# EAGLE design DRV10987 (EAGLE 8.7.1)
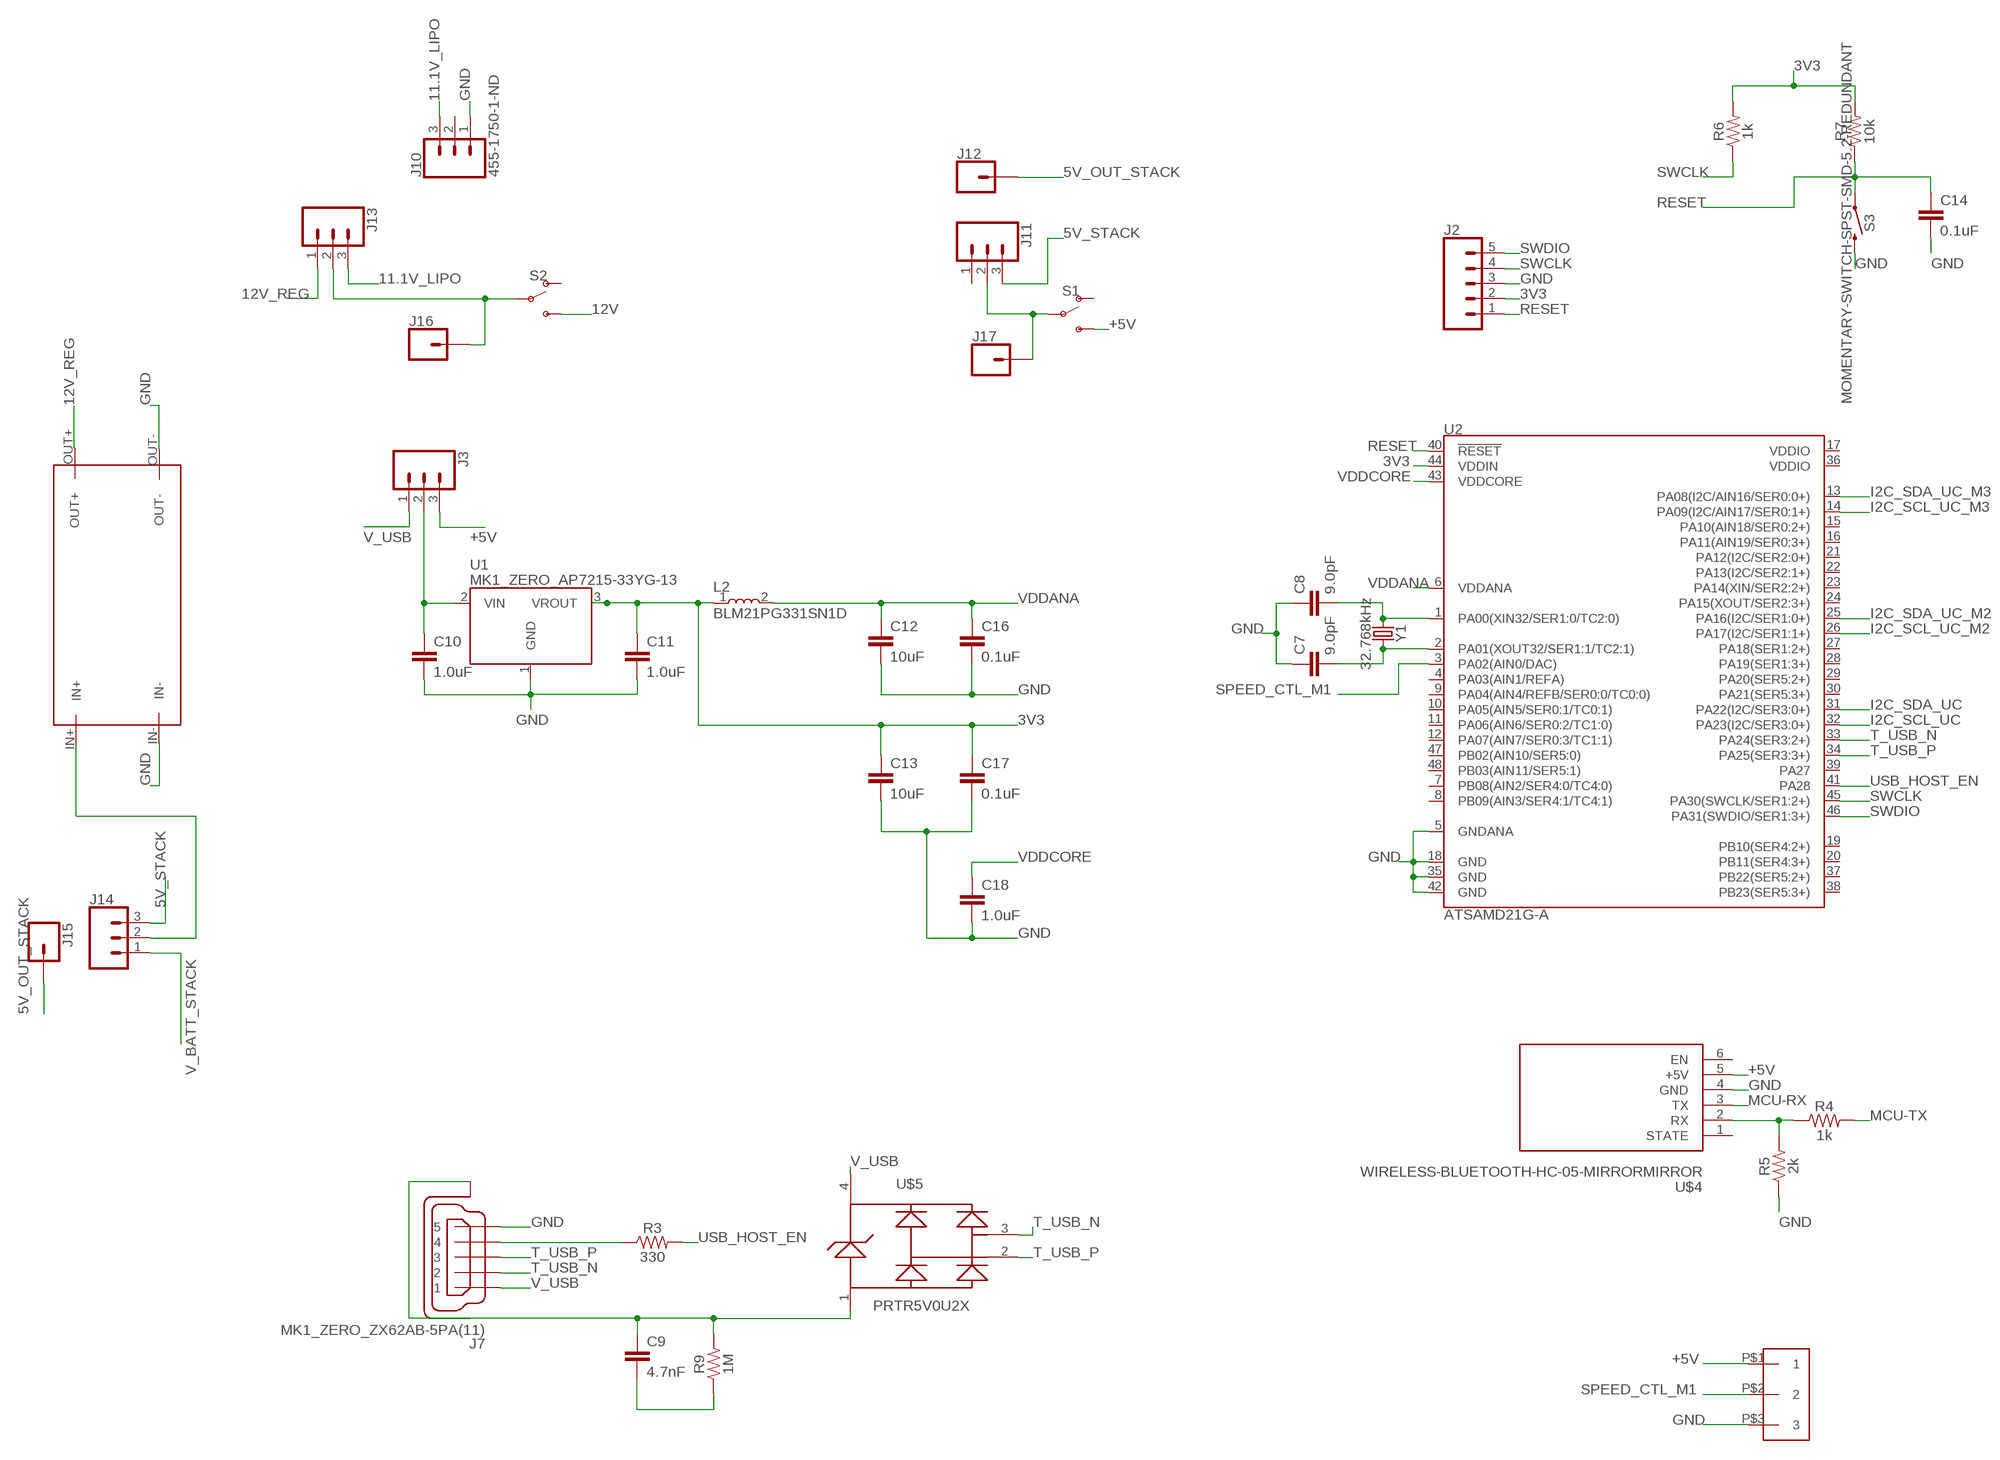
[diagram p0: schematic, sheet 1, part 1 of 2]
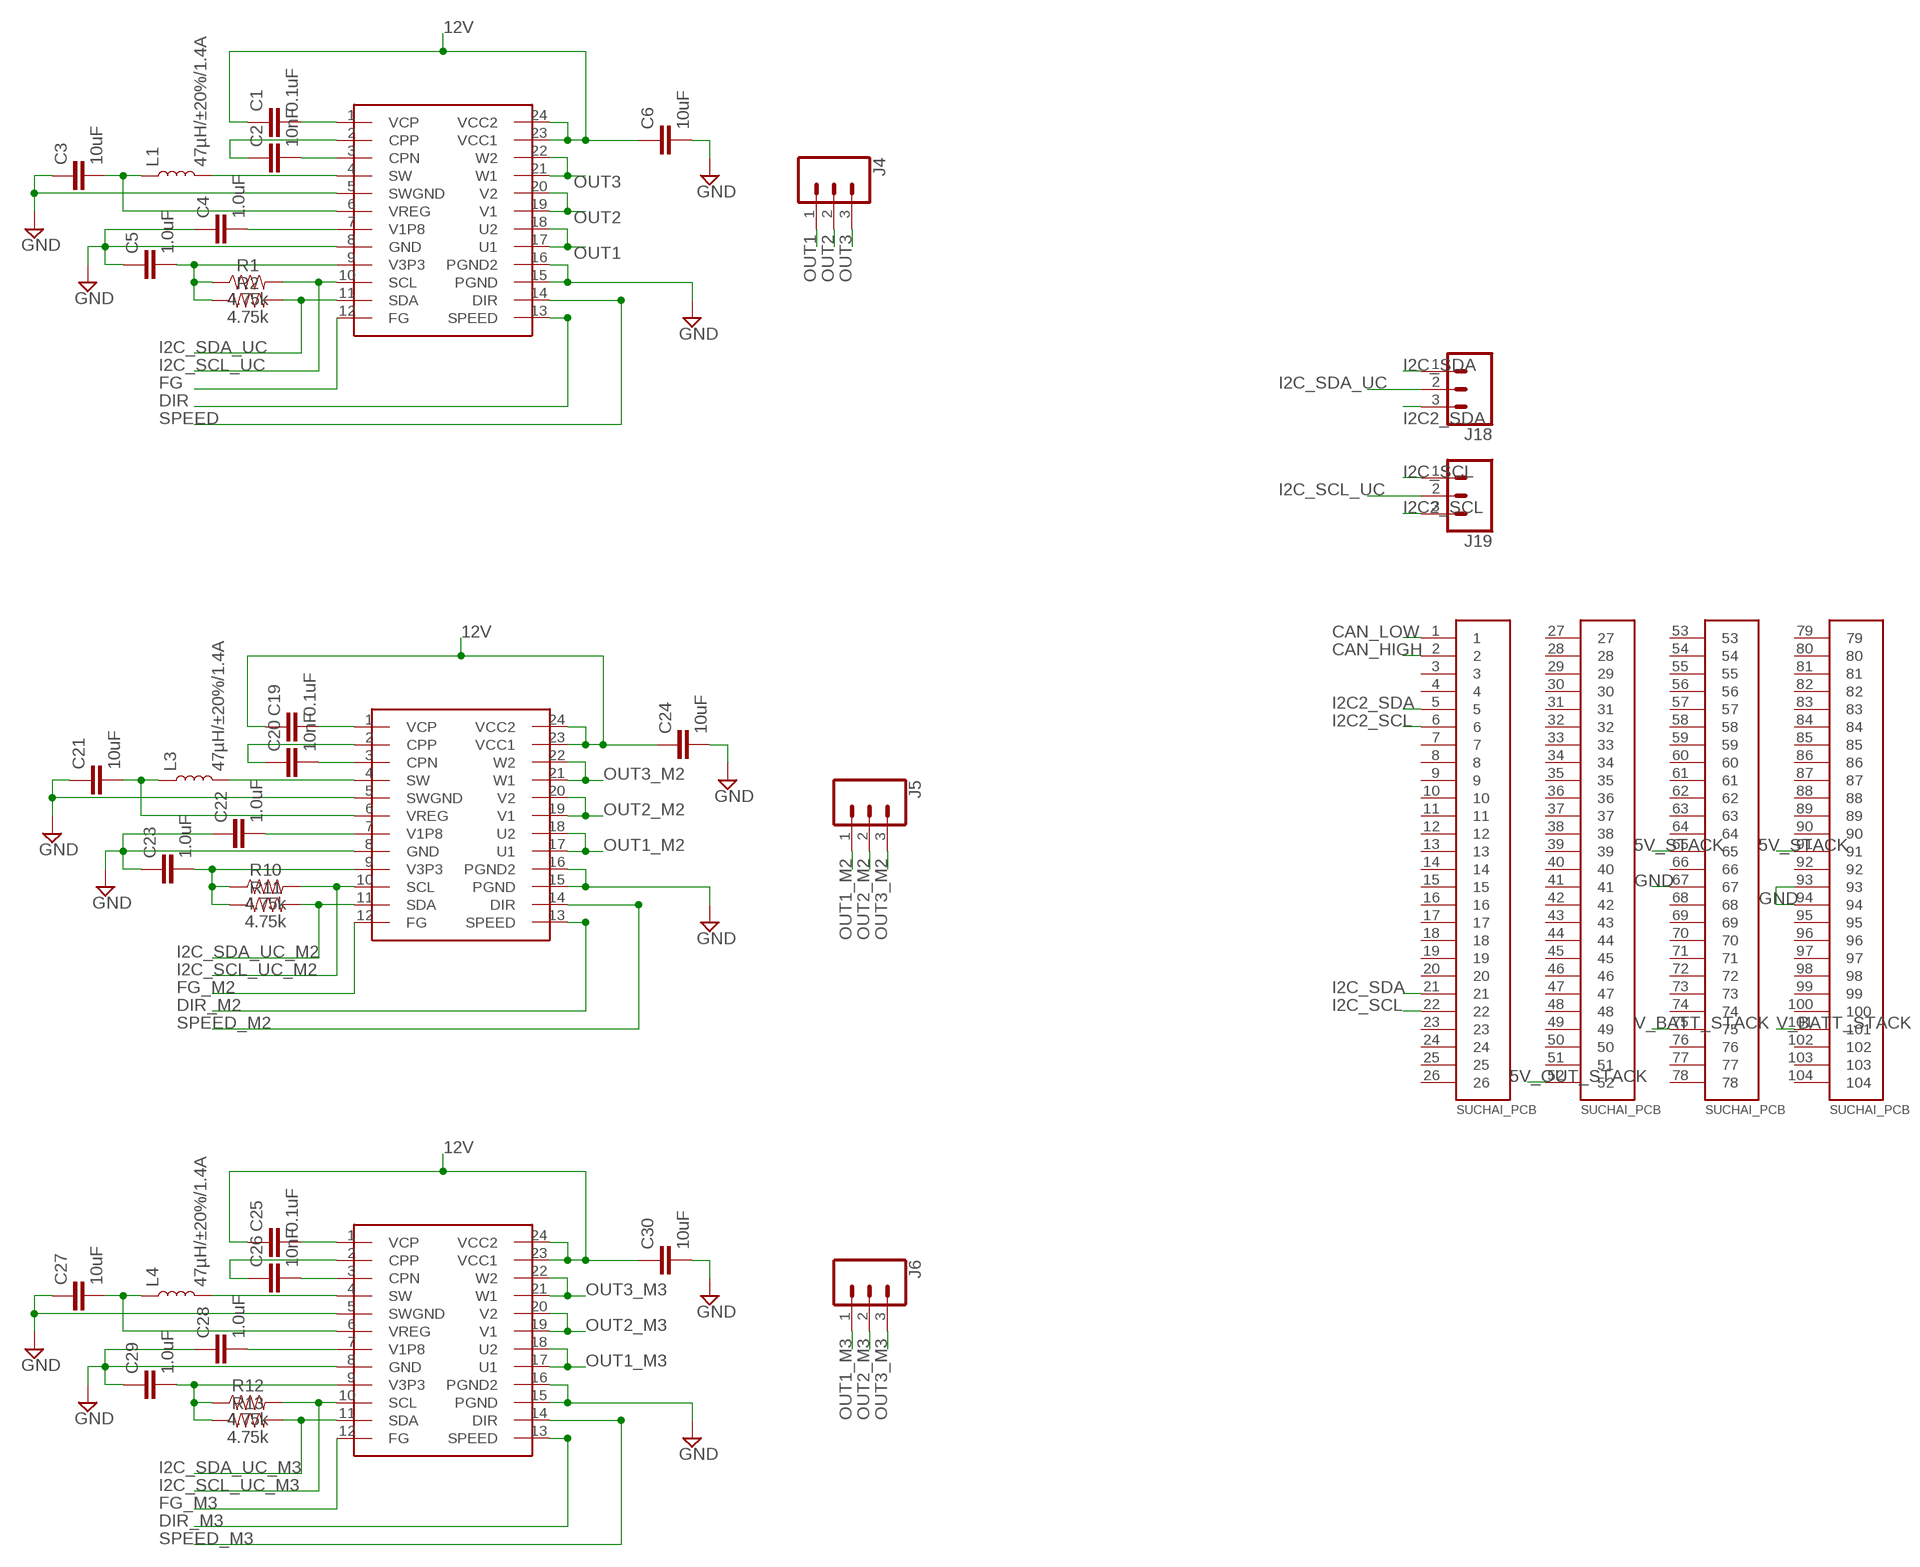
[diagram p1: schematic, sheet 1, part 2 of 2]

## Parts
C1  0.1uF  1.0UF-0805-25V-10%  [0805]
C2  10nF  1.0UF-0805-25V-10%  [0805]
C3  10uF  1.0UF-0805-25V-10%  [0805]
C4  1.0uF  1.0UF-0805-25V-10%  [0805]
C5  1.0uF  1.0UF-0805-25V-10%  [0805]
C6  10uF  1.0UF-0805-25V-10%  [0805]
C7  9.0pF  9.0PF-0603-50V-10%  [0603]
C8  9.0pF  9.0PF-0603-50V-10%  [0603]
C9  4.7nF  4.7PF-0603-50V-5%  [0603]
C10  1.0uF  1.0UF-0805-25V-(+80/-20%)  [0805]
C11  1.0uF  1.0UF-0805-25V-(+80/-20%)  [0805]
C12  10uF  10UF-0805-10V-10%  [0805]
C13  10uF  10UF-0805-10V-10%  [0805]
C14  0.1uF  1.0UF-0805-25V-(+80/-20%)  [0805]
C16  0.1uF  1.0UF-0805-25V-(+80/-20%)  [0805]
C17  0.1uF  1.0UF-0805-25V-(+80/-20%)  [0805]
C18  1.0uF  1.0UF-0805-25V-(+80/-20%)  [0805]
C19  0.1uF  1.0UF-0805-25V-10%  [0805]
C20  10nF  1.0UF-0805-25V-10%  [0805]
C21  10uF  1.0UF-0805-25V-10%  [0805]
C22  1.0uF  1.0UF-0805-25V-10%  [0805]
C23  1.0uF  1.0UF-0805-25V-10%  [0805]
C24  10uF  1.0UF-0805-25V-10%  [0805]
C25  0.1uF  1.0UF-0805-25V-10%  [0805]
C26  10nF  1.0UF-0805-25V-10%  [0805]
C27  10uF  1.0UF-0805-25V-10%  [0805]
C28  1.0uF  1.0UF-0805-25V-10%  [0805]
C29  1.0uF  1.0UF-0805-25V-10%  [0805]
C30  10uF  1.0UF-0805-25V-10%  [0805]
J1  SUCHAI_PCB  [SUCHAI_PCB]
J2  CONN_05LOCK_LONGPADS  [1X05_LOCK_LONGPADS]
J3  CONN_03LOCK_LONGPADS  [1X03_LOCK_LONGPADS]
J4  CONN_03LOCK  [1X03_LOCK]
J5  CONN_03LOCK  [1X03_LOCK]
J6  CONN_03LOCK  [1X03_LOCK]
J7  MK1_ZERO_ZX62AB-5PA(11)  [MK1_ZERO_USBMICRO-ZX62-AB-5PA]
J10  455-1750-1-ND  CONN_03  [1X03]
J11  CONN_03LOCK  [1X03_LOCK]
J12  CONN_01  [1X01]
J13  CONN_03LOCK  [1X03_LOCK]
J14  CONN_03LOCK  [1X03_LOCK]
J15  CONN_01  [1X01]
J16  CONN_01  [1X01]
J17  CONN_01  [1X01]
J18  CONN_03LOCK  [1X03_LOCK]
J19  CONN_03LOCK  [1X03_LOCK]
L1  47µH/±20%/1.4A  INDUCTOR-SRN6045-33UH  [SRN6045]
L2  BLM21PG331SN1D  [INDC2012X87]
L3  47µH/±20%/1.4A  INDUCTOR-SRN6045-33UH  [SRN6045]
L4  47µH/±20%/1.4A  INDUCTOR-SRN6045-33UH  [SRN6045]
R1  4.75k  RESISTOR0805  [0805]
R2  4.75k  RESISTOR0805  [0805]
R3  330  330OHM-0603-1/10W-1%  [0603]
R4  1k  1KOHM-HORIZ-1/4W-5%  [AXIAL-0.3]
R5  2k  RESISTORAXIAL-0.3  [AXIAL-0.3]
R6  1k  1KOHM-0603-1/10W-1%  [0603]
R7  10k  10KOHM-0603-1/10W-1%  [0603]
R9  1M  1MOHM-0603-1/4W-5%  [0603]
R10  4.75k  RESISTOR0805  [0805]
R11  4.75k  RESISTOR0805  [0805]
R12  4.75k  RESISTOR0805  [0805]
R13  4.75k  RESISTOR0805  [0805]
S1  SWITCH-SPDT-PTH-11.6X4.0MM  [SWITCH_SPDT_PTH_11.6X4.0MM]
S2  SWITCH-SPDT-PTH-11.6X4.0MM  [SWITCH_SPDT_PTH_11.6X4.0MM]
S3  MOMENTARY-SWITCH-SPST-SMD-5.2-REDUNDANT  [TACTILE_SWITCH_SMD_5.2MM]
U1  MK1_ZERO_AP7215-33YG-13  [MK1_ZERO_SOT150P400X160-3N]
U2  ATSAMD21G-A  [TQFP-48]
U$1  DRV10987  [DRV10987]
U$2  XL6009E1_MODULE  [XL6009E1_MODULE]
U$3  CONN_03_SMD_SMALL  [CONN_03_SMD_SMALL]
U$4  WIRELESS-BLUETOOTH-HC-05-MIRRORMIRROR  [WIRELESS-BLUETOOTH-HC-05-MIRROR]
U$5  ARDUINO_PRTR5V0U2XB  [ARDUINO_SOT143B]
U$6  DRV10987  [DRV10987]
U$7  DRV10987  [DRV10987]
Y1  32.768kHz  CRYSTAL-32.768KHZSMD-3.2X1.5  [CRYSTAL-SMD-3.2X1.5MM]

## Nets
3V3: C11.1 C13.1 C17.1 J2.2 L2.1 R6.2 R7.2 U1.3(VROUT) U2.44(VDDIN)
5V_OUT_STACK: J1.52 J12.1 J15.1
5V_STACK: J1.65 J1.91 J11.3 J14.3
11.1V_LIPO: J10.3 J13.3
12V: C1.1 C6.1 C19.1 C24.1 C25.1 C30.1 S2.3(S) U$1.23(VCC1) U$1.24(VCC2) U$6.23(VCC1) U$6.24(VCC2) U$7.23(VCC1) U$7.24(VCC2)
12V_REG: J13.1 U$2.OUT+
+5V: J3.3 S1.3(S) U$3.P$1 U$4.5(+5V)
CAN_HIGH: J1.2
CAN_LOW: J1.1
DIR: U$1.13(SPEED)
DIR_M2: U$6.13(SPEED)
DIR_M3: U$7.13(SPEED)
FG: U$1.12(FG)
FG_M2: U$6.12(FG)
FG_M3: U$7.12(FG)
GND: C3.1 C4.1 C5.1 C6.2 C7.1 C8.1 C10.2 C11.2 C12.2 C13.2 C14.2 C16.2 C17.2 C18.2 C21.1 C22.1 C23.1 C24.2 C27.1 C28.1 C29.1 C30.2 J1.67 J1.93 J1.94 J2.3 J7.5 J10.1 R5.P$1 S3.3 S3.4 U1.1(GND) U2.5(GNDANA) U2.18(GND) U2.35(GND) U2.42(GND) U$1.5(SWGND) U$1.8(GND) U$1.15(PGND) U$1.16(PGND2) U$2.IN- U$2.OUT- U$3.P$3 U$4.4(GND) U$6.5(SWGND) U$6.8(GND) U$6.15(PGND) U$6.16(PGND2) U$7.5(SWGND) U$7.8(GND) U$7.15(PGND) U$7.16(PGND2)
I2C2_SCL: J1.6 J19.3
I2C2_SDA: J1.5 J18.3
I2C_SCL: J1.22 J19.1
I2C_SCL_UC: J19.2 R1.2 U2.32(PA23(I2C/SER3:0+)) U$1.10(SCL)
I2C_SCL_UC_M2: R10.2 U2.26(PA17(I2C/SER1:1+)) U$6.10(SCL)
I2C_SCL_UC_M3: R12.2 U2.14(PA09(I2C/AIN17/SER0:1+)) U$7.10(SCL)
I2C_SDA: J1.21 J18.1
I2C_SDA_UC: J18.2 R2.2 U2.31(PA22(I2C/SER3:0+)) U$1.11(SDA)
I2C_SDA_UC_M2: R11.2 U2.25(PA16(I2C/SER1:0+)) U$6.11(SDA)
I2C_SDA_UC_M3: R13.2 U2.13(PA08(I2C/AIN16/SER0:0+)) U$7.11(SDA)
MCU-RX: U$4.3(TX)
MCU-TX: R4.P$2
N$1: C1.2 U$1.1(VCP)
N$2: C2.1 U$1.2(CPP)
N$3: C2.2 U$1.3(CPN)
N$4: L1.2 U$1.4(SW)
N$5: J11.2 J17.1 S1.2(P)
N$6: C3.2 L1.1 U$1.6(VREG)
N$7: C4.2 U$1.7(V1P8)
N$8: C7.2 U2.2(PA01(XOUT32/SER1:1/TC2:1)) Y1.P$2
N$9: C5.2 R1.1 R2.1 U$1.9(V3P3)
N$10: C8.2 U2.1(PA00(XIN32/SER1:0/TC2:0)) Y1.P$1
N$11: J7.4 R3.1
N$13: R4.P$1 R5.P$2 U$4.2(RX)
N$16: J13.2 J16.1 S2.2(P)
N$17: C9.1 J7.6(SH) J7.7(SH) J7.8(SH) J7.9(SH) J7.10(SH) J7.11(SH) R9.2 U$5.1
N$18: J14.2 U$2.IN+
N$19: C9.2 R9.1
N$20: C10.1 J3.2 U1.2(VIN)
N$22: C19.2 U$6.1(VCP)
N$23: C20.1 U$6.2(CPP)
N$24: C20.2 U$6.3(CPN)
N$25: L3.2 U$6.4(SW)
N$26: C21.2 L3.1 U$6.6(VREG)
N$27: C22.2 U$6.7(V1P8)
N$28: C23.2 R10.1 R11.1 U$6.9(V3P3)
N$29: C25.2 U$7.1(VCP)
N$30: C26.1 U$7.2(CPP)
N$31: C26.2 U$7.3(CPN)
N$32: L4.2 U$7.4(SW)
N$33: C27.2 L4.1 U$7.6(VREG)
N$34: C28.2 U$7.7(V1P8)
N$35: C29.2 R12.1 R13.1 U$7.9(V3P3)
OUT1: J4.1 U$1.17(U1) U$1.18(U2)
OUT1_M2: J5.1 U$6.17(U1) U$6.18(U2)
OUT1_M3: J6.1 U$7.17(U1) U$7.18(U2)
OUT2: J4.2 U$1.19(V1) U$1.20(V2)
OUT2_M2: J5.2 U$6.19(V1) U$6.20(V2)
OUT2_M3: J6.2 U$7.19(V1) U$7.20(V2)
OUT3: J4.3 U$1.21(W1) U$1.22(W2)
OUT3_M2: J5.3 U$6.21(W1) U$6.22(W2)
OUT3_M3: J6.3 U$7.21(W1) U$7.22(W2)
RESET: C14.1 J2.1 R7.1 S3.1 S3.2 U2.40(!RESET!)
SPEED: U$1.14(DIR)
SPEED_CTL_M1: U2.3(PA02(AIN0/DAC)) U$3.P$2
SPEED_M2: U$6.14(DIR)
SPEED_M3: U$7.14(DIR)
SWCLK: J2.4 R6.1 U2.45(PA30(SWCLK/SER1:2+))
SWDIO: J2.5 U2.46(PA31(SWDIO/SER1:3+))
T_USB_N: J7.2 U2.33(PA24(SER3:2+)) U$5.3
T_USB_P: J7.3 U2.34(PA25(SER3:3+)) U$5.2
USB_HOST_EN: R3.2 U2.41(PA28)
V_BATT_STACK: J1.75 J1.101 J14.1
V_USB: J3.1 J7.1 U$5.4
VDDANA: C12.1 C16.1 L2.2 U2.6(VDDANA)
VDDCORE: C18.1 U2.43(VDDCORE)
Unconnected: J1.3 J1.4 J1.7 J1.8 J1.9 J1.10 J1.11 J1.12 J1.13 J1.14 J1.15 J1.16 J1.17 J1.18 J1.19 J1.20 J1.23 J1.24 J1.25 J1.26 J1.27 J1.28 J1.29 J1.30 J1.31 J1.32 J1.33 J1.34 J1.35 J1.36 J1.37 J1.38 J1.39 J1.40 J1.41 J1.42 J1.43 J1.44 J1.45 J1.46 J1.47 J1.48 J1.49 J1.50 J1.51 J1.53 J1.54 J1.55 J1.56 J1.57 J1.58 J1.59 J1.60 J1.61 J1.62 J1.63 J1.64 J1.66 J1.68 J1.69 J1.70 J1.71 J1.72 J1.73 J1.74 J1.76 J1.77 J1.78 J1.79 J1.80 J1.81 J1.82 J1.83 J1.84 J1.85 J1.86 J1.87 J1.88 J1.89 J1.90 J1.92 J1.95 J1.96 J1.97 J1.98 J1.99 J1.100 J1.102 J1.103 J1.104 J10.2 J11.1 S1.1(O) S2.1(O) U2.4(PA03(AIN1/REFA)) U2.7(PB08(AIN2/SER4:0/TC4:0)) U2.8(PB09(AIN3/SER4:1/TC4:1)) U2.9(PA04(AIN4/REFB/SER0:0/TC0:0)) U2.10(PA05(AIN5/SER0:1/TC0:1)) U2.11(PA06(AIN6/SER0:2/TC1:0)) U2.12(PA07(AIN7/SER0:3/TC1:1)) U2.15(PA10(AIN18/SER0:2+)) U2.16(PA11(AIN19/SER0:3+)) U2.17(VDDIO) U2.19(PB10(SER4:2+)) U2.20(PB11(SER4:3+)) U2.21(PA12(I2C/SER2:0+)) U2.22(PA13(I2C/SER2:1+)) U2.23(PA14(XIN/SER2:2+)) U2.24(PA15(XOUT/SER2:3+)) U2.27(PA18(SER1:2+)) U2.28(PA19(SER1:3+)) U2.29(PA20(SER5:2+)) U2.30(PA21(SER5:3+)) U2.36(VDDIO) U2.37(PB22(SER5:2+)) U2.38(PB23(SER5:3+)) U2.39(PA27) U2.47(PB02(AIN10/SER5:0)) U2.48(PB03(AIN11/SER5:1)) U$4.1(STATE) U$4.6(EN)

## Library data of the parts
C1-C3 C6 C19-C21 C24-C27 C30 = SparkFun-Capacitors:1.0UF: 1µF ceramic capacitors A capacitor is a passive two-terminal electrical component used to store electrical energy temporarily in an electric field.; PROD_ID: CAP-08064; VALUE: 1.0uF
C4 C5 C22 C23 C28 C29 = SparkFun-Capacitors:1.0UF: 1µF ceramic capacitors A capacitor is a passive two-terminal electrical component used to store electrical energy temporarily in an electric field.; PROD_ID: CAP-08064
C7 C8 = SparkFun-Capacitors:9.0PF: 9.0pF ceramic capacitors A capacitor is a passive two-terminal electrical component used to store electrical energy temporarily in an electric field.; PROD_ID: CAP-09341
C9 = SparkFun-Capacitors:4.7PF: 4.7pF ceramic capacitors A capacitor is a passive two-terminal electrical component used to store electrical energy temporarily in an electric field.; PROD_ID: CAP-07880; VALUE: 4.7pF
C10 C11 C18 = SparkFun-Capacitors:1.0UF: 1µF ceramic capacitors A capacitor is a passive two-terminal electrical component used to store electrical energy temporarily in an electric field.; PROD_ID: CAP-11625
C12 C13 = SparkFun-Capacitors:10UF: 10.0µF ceramic capacitors A capacitor is a passive two-terminal electrical component used to store electrical energy temporarily in an electric field.; PROD_ID: CAP-11330
C14 C16 C17 = SparkFun-Capacitors:1.0UF: 1µF ceramic capacitors A capacitor is a passive two-terminal electrical component used to store electrical energy temporarily in an electric field.; PROD_ID: CAP-11625; VALUE: 1.0uF
J1 = SUCHAI_PCB:SUCHAI_PCB: ASSEMBLY, SOCKET STRIP .016 X .031 TAIL.
J2 = SparkFun-Connectors:CONN_05: Multi connection point. Often used as Generic Header-pin footprint for 0.1 inch spaced/style header connections On any of the 0.1 inch spaced packages, you can populate with these: Break Away Headers - Straight <https://www.sparkfun.com/products/116> (PRT-00116) Break Away Male Headers - Right Angle <https://www.sparkfun.com/products/553> (PRT-00553) Female Headers <https://www.sparkfun.com/products/115> (PRT-00115) Break Away Headers - Machine Pin <https://www.sparkfun.com/products/117> (PRT-00117) Break Away Female Headers - Swiss Machine Pin <https://www.sparkfun.com/products/743> (PRT-00743) For SCREWTERMINALS and SPRING TERMINALS visit here: Screw Terimnals on SparkFun.com <https://www.sparkfun.com/search/results?term=Screw+Terminals> (5mm/3.5mm/2.54mm spacing) This device is also useful as a general connection point to wire up your design to another part of your project. Our various solder wires solder well into these plated through hole pads. Hook-Up Wire - Assortment (Stranded, 22 AWG) <https://www.sparkfun.com/products/11375> (PRT-11375) Hook-Up Wire - Assortment (Solid Core, 22 AWG) <https://www.sparkfun.com/products/11367> (PRT-11367) View the entire wire category on our website here <https://www.sparkfun.com/categories/141> Special notes: Molex polarized connector foot print use with SKU : PRT-08231 with associated crimp pins and housings. 1MM SMD Version SKU: PRT-10208
J3-J6 J11 J13 J14 J18 J19 = SparkFun-Connectors:CONN_03: Multi connection point. Often used as Generic Header-pin footprint for 0.1 inch spaced/style header connections On any of the 0.1 inch spaced packages, you can populate with these: Break Away Headers - Straight <https://www.sparkfun.com/products/116> (PRT-00116) Break Away Male Headers - Right Angle <https://www.sparkfun.com/products/553> (PRT-00553) Female Headers <https://www.sparkfun.com/products/115> (PRT-00115) Break Away Headers - Machine Pin <https://www.sparkfun.com/products/117> (PRT-00117) Break Away Female Headers - Swiss Machine Pin <https://www.sparkfun.com/products/743> (PRT-00743) Stackable Header - 3 Pin (Female, 0.1") <https://www.sparkfun.com/products/13875> (PRT-13875) For SCREWTERMINALS and SPRING TERMINALS visit here: Screw Terimnals on SparkFun.com <https://www.sparkfun.com/search/results?term=Screw+Terminals> (5mm/3.5mm/2.54mm spacing) This device is also useful as a general connection point to wire up your design to another part of your project. Our various solder wires solder well into these plated through hole pads. Hook-Up Wire - Assortment (Stranded, 22 AWG) <https://www.sparkfun.com/products/11375> (PRT-11375) Hook-Up Wire - Assortment (Solid Core, 22 AWG) <https://www.sparkfun.com/products/11367> (PRT-11367) View the entire wire category on our website here <https://www.sparkfun.com/categories/141> Special notes: Molex polarized connector foot print use with SKU : PRT-08232 with associated crimp pins and housings.
J7 = MKRZero_V5.0:MK1_ZERO_ZX62AB-5PA(11)
J10 = SparkFun-Connectors:CONN_03: Multi connection point. Often used as Generic Header-pin footprint for 0.1 inch spaced/style header connections On any of the 0.1 inch spaced packages, you can populate with these: Break Away Headers - Straight <https://www.sparkfun.com/products/116> (PRT-00116) Break Away Male Headers - Right Angle <https://www.sparkfun.com/products/553> (PRT-00553) Female Headers <https://www.sparkfun.com/products/115> (PRT-00115) Break Away Headers - Machine Pin <https://www.sparkfun.com/products/117> (PRT-00117) Break Away Female Headers - Swiss Machine Pin <https://www.sparkfun.com/products/743> (PRT-00743) Stackable Header - 3 Pin (Female, 0.1") <https://www.sparkfun.com/products/13875> (PRT-13875) For SCREWTERMINALS and SPRING TERMINALS visit here: Screw Terimnals on SparkFun.com <https://www.sparkfun.com/search/results?term=Screw+Terminals> (5mm/3.5mm/2.54mm spacing) This device is also useful as a general connection point to wire up your design to another part of your project. Our various solder wires solder well into these plated through hole pads. Hook-Up Wire - Assortment (Stranded, 22 AWG) <https://www.sparkfun.com/products/11375> (PRT-11375) Hook-Up Wire - Assortment (Solid Core, 22 AWG) <https://www.sparkfun.com/products/11367> (PRT-11367) View the entire wire category on our website here <https://www.sparkfun.com/categories/141> Special notes: Molex polarized connector foot print use with SKU : PRT-08232 with associated crimp pins and housings.; PROD_ID: XXX-00000
J12 J15-J17 = SparkFun-Connectors:CONN_01: Single connection point. Often used as Generic Header-pin footprint for 0.1 inch spaced/style header connections On any of the 0.1 inch spaced packages, you can populate with these: Break Away Headers - Straight <https://www.sparkfun.com/products/116> (PRT-00116) Break Away Male Headers - Right Angle <https://www.sparkfun.com/products/553> (PRT-00553) Female Headers <https://www.sparkfun.com/products/115> (PRT-00115) Break Away Headers - Machine Pin <https://www.sparkfun.com/products/117> (PRT-00117) Break Away Female Headers - Swiss Machine Pin <https://www.sparkfun.com/products/743> (PRT-00743) This device is also useful as a general connection point to wire up your design to another part of your project. Our various solder wires solder well into these plated through hole pads. Hook-Up Wire - Assortment (Stranded, 22 AWG) <https://www.sparkfun.com/products/11375> (PRT-11375) Hook-Up Wire - Assortment (Solid Core, 22 AWG) <https://www.sparkfun.com/products/11367> (PRT-11367) View the entire wire category on our website here <https://www.sparkfun.com/categories/141> Special notes: SMTSO-256-ET is a "flush mount" nut for a 4-40 screw. We mostly use this on specialty testbeds; it is a nice way to connect hardware to your PCB at an adjustable hieght. Also note, the SNAP packages are for using a snappable style connector. We sell a baggie of snaps and they are also used on two LilyPad designs: Snap Assortment - 30 pack (male and female) <https://www.sparkfun.com/products/11347> (DEV-11347) LilyPad Arduino SimpleSnap <https://www.sparkfun.com/products/10941> (DEV-10941) LilyPad SimpleSnap Protoboard <https://www.sparkfun.com/products/10940> (DEV-10940)
L1 L3 L4 = SparkFun-Coils:INDUCTOR: Inductors Resist changes in electrical current. Basically a coil of wire. SparkFun Products: SparkFun Load Cell Amplifier - HX711 <https://www.sparkfun.com/products/13879> IOIO-OTG - V2.2 <https://www.sparkfun.com/products/13613>; PROD_ID: NDUC-11627; VALUE: 33µH/±20%/1.4A
L2 = Common-Parts-Library-Eagle:BLM21PG331SN1D: Ferrite Beads Multi-Layer 330Ohm 25% 100MHz 1.5A 70mOhm DCR 0805 Paper T/R; MANUFACTURER: MURATA
R1 R2 R10-R13 = SparkFun-Resistors:RESISTOR: Generic Resistor Package
R3 = SparkFun-Resistors:330OHM: 330Ω resistor A resistor is a passive two-terminal electrical component that implements electrical resistance as a circuit element. Resistors act to reduce current flow, and, at the same time, act to lower voltage levels within circuits. - Wikipedia; PROD_ID: RES-00818
R4 = resistors-longpads:1KOHM: 1kΩ resistor A resistor is a passive two-terminal electrical component that implements electrical resistance as a circuit element. Resistors act to reduce current flow, and, at the same time, act to lower voltage levels within circuits. - Wikipedia; PROD_ID: RES-08380
R5 = resistors-longpads:RESISTOR: Generic Resistor Package
R6 = SparkFun-Resistors:1KOHM: 1kΩ resistor A resistor is a passive two-terminal electrical component that implements electrical resistance as a circuit element. Resistors act to reduce current flow, and, at the same time, act to lower voltage levels within circuits. - Wikipedia; PROD_ID: RES-07856
R7 = SparkFun-Resistors:10KOHM: 10kΩ resistor A resistor is a passive two-terminal electrical component that implements electrical resistance as a circuit element. Resistors act to reduce current flow, and, at the same time, act to lower voltage levels within circuits. - Wikipedia; PROD_ID: RES-00824
R9 = SparkFun-Resistors:1MOHM: 1MΩ resistor A resistor is a passive two-terminal electrical component that implements electrical resistance as a circuit element. Resistors act to reduce current flow, and, at the same time, act to lower voltage levels within circuits. - Wikipedia; PROD_ID: RES-07868
S1 S2 = SparkFun-Switches:SWITCH-SPDT: Single Pole, Double Throw (SPDT) Switch Single-pole, double-throw (SPDT) switch. Variant Overview SMD-AYZ0202 Surface Mount DPDT Switch <https://www.sparkfun.com/products/597> (COM-00597) Used on e.g. LilyPad Arduino USB - ATmega32U4 Board <https://www.sparkfun.com/products/12049> PTH-11.6X4.0MM SPDT Mini Power Switch <https://www.sparkfun.com/products/102> (COM-00102) Used on e.g. SparkFun Simon Says - Through-Hole Soldering Kit <https://www.sparkfun.com/products/10547> (KIT-10547) PTH-11.6X4.0MM-KIT KIT version of SPDT Mini Power Switch - Simplifies soldering by removing tStop of switch pins - only one side can be soldered. PTH-11.6X4.0MM-LOCK LOCK version of SPDT Mini Power Switch - Offset pins hold switch in place for easier soldering. SMD-RIGHT-ANGLE Surface Mount Right Angle Switch <https://www.sparkfun.com/products/10860> (COM-10860) Used on e.g. SparkFun ESP8266 Thing <https://www.sparkfun.com/products/13231>; PROD_ID: SWCH-08261; SF_SKU: COM-00102
S3 = SparkFun-Switches:MOMENTARY-SWITCH-SPST: Momentary Switch (Pushbutton) - SPST Normally-open (NO) SPST momentary switches (buttons, pushbuttons). Variants PTH-12MM - 12mm square, through-hole Momentary Pushbutton Switch - 12mm Square <https://www.sparkfun.com/products/9190> (COM-09190) PTH-6.0MM, PTH-6.0MM-KIT - 6.0mm square, through-hole Mini Pushbutton Switch <https://www.sparkfun.com/products/97> (COM-00097) KIT package intended for soldering kit's - only one side of pads' copper is exposed. PTH-RIGHT-ANGLE-KIT - Right-angle, through-hole Right Angle Tactile Button <https://www.sparkfun.com/products/10791> - Used on SparkFun BigTime Watch Kit <https://www.sparkfun.com/products/11734> SMD-12MM - 12mm square, surface-mount Tactile Button - SMD (12mm) <https://www.sparkfun.com/products/12993> (COM-12993) Used on SparkFun PicoBoard <https://www.sparkfun.com/products/11888> SMD-4.5MM - 4.5mm Square Trackball Switch Used on SparkFun Blackberry Trackballer Breakout <https://www.sparkfun.com/products/13169> SMD-4.6MMX2.8MM - 4.60mm x 2.80mm, surface mount Used on SparkFun SAMD21 Mini Breakout <https://www.sparkfun.com/products/13664> SMD-5.2MM, SMD-5.2-REDUNDANT - 5.2mm square, surface-mount Mini Pushbutton Switch - SMD <https://www.sparkfun.com/products/8720> (COM-08720) Used on Arduino Pro Mini <https://www.sparkfun.com/products/11114> REDUNDANT package connects both switch circuits together SMD-6.0X3.5MM - 6.0 x 3.5mm, surface mount Momentary Reset Switch SMD <https://www.sparkfun.com/products/8229> (COM-08229) SMD-6.2MM-TALL - 6.2mm square, surface mount Tactile Button - SMD (6mm) <https://www.sparkfun.com/products/12992> Used on SparkFun Digital Sandbox <https://www.sparkfun.com/products/12651> SMD-RIGHT-ANGLE - Right-angle, surface mount Used on SparkFun Block for Intel® Edison - Arduino <https://www.sparkfun.com/products/13036>; PROD_ID: SWCH-08247; SF_SKU: COM-08720
U1 = MKRZero_V5.0:MK1_ZERO_AP7215-33YG-13: IC REG LDO 3.3V 0.6A SOT89-3 Datasheet <http://www.diodes.com/_files/datasheets/AP7215.pdf>; DESCR: IC REG LDO 3.3V 0.6A SOT89-3; MF: Diodes Inc; MPN: AP7215-33YG-13
U2 = SparkFun-IC-Microcontroller:ATSAMD21G: Atmel SAMD21G SMART ARM-Based Microcontroller The Atmel ® | SMART ™ SAM D21 is a series of low-power microcontrollers using the 32-bit ARM ® Cortex ® -M0+ processor, and ranging from 32- to 64-pins with up to 256KB Flash and 32KB of SRAM. The SAM D21 devices operate at a maximum frequency of 48MHz and reach 2.46 CoreMark/MHz. They are designed for simple and intuitive migration with identical peripheral modules, hex compatible code, identical linear address map and pin compatible migration paths between all devices in the product series. All devices include intelligent and flexible peripherals, Atmel Event System for inter-peripheral signaling, and support for capacitive touch button, slider and wheel user interfaces. Datasheet <https://cdn.sparkfun.com/datasheets/Dev/Arduino/Boards/Atmel-42181-SAM-D21_Datasheet.pdf> SparkFun Products SparkFun SAMD21 Mini Breakout <https://www.sparkfun.com/products/13664> (DEV-13664) SparkFun SAMD21 Dev Breakout <https://www.sparkfun.com/products/13672> (DEV-13672); PROD_ID: IC-13064
U$1 U$6 U$7 = BLDC_DRIVER:DRV10987
U$2 = BLDC_DRIVER:XL6009E1_MODULE: High-performance step-up switching current (BOOST) module. Input Range 3V ~ 32V Output Range 5V ~ 35V Input Current 4A max Conversion efficiency ~94% Switching frequency 400KHz Working temperature -40 ° C ~ +85 ° C Dimensions 43mm * 21mm * 14mm (length * width* height)
U$3 = BLDC_DRIVER:CONN_03_SMD_SMALL
U$4 = diy-modules:WIRELESS-BLUETOOTH-HC-05-MIRROR: Bluetooth Transceiver Module based on HC-05 board Tutorial is available here: https://arduino-info.wikispaces.com/BlueTooth-HC05-HC06-Modules-How-To Click here to find device on ebay.com <http://www.ebay.com/sch/hc-05+module+rs232>
U$5 = Zero_V1.0:ARDUINO_PRTR5V0U2X
Y1 = SparkFun-Clocks:CRYSTAL-32.768KHZ: 32.768kHz Crystal Frequency: 32.768kHz Frequency Stability: ±20ppm Load Capacitance: 12.5pF (PTH-2X6 & SMD-3.2X1.5), 6pF (SMD-2X6) SparkFun Products: SparkFun BigTime Watch Kit <https://www.sparkfun.com/products/11734> SparkFun nRF52832 Breakout <https://www.sparkfun.com/products/13990> SparkFun Real Time Clock Module <https://www.sparkfun.com/products/12708>; PROD_ID: XTAL-13062

## Board
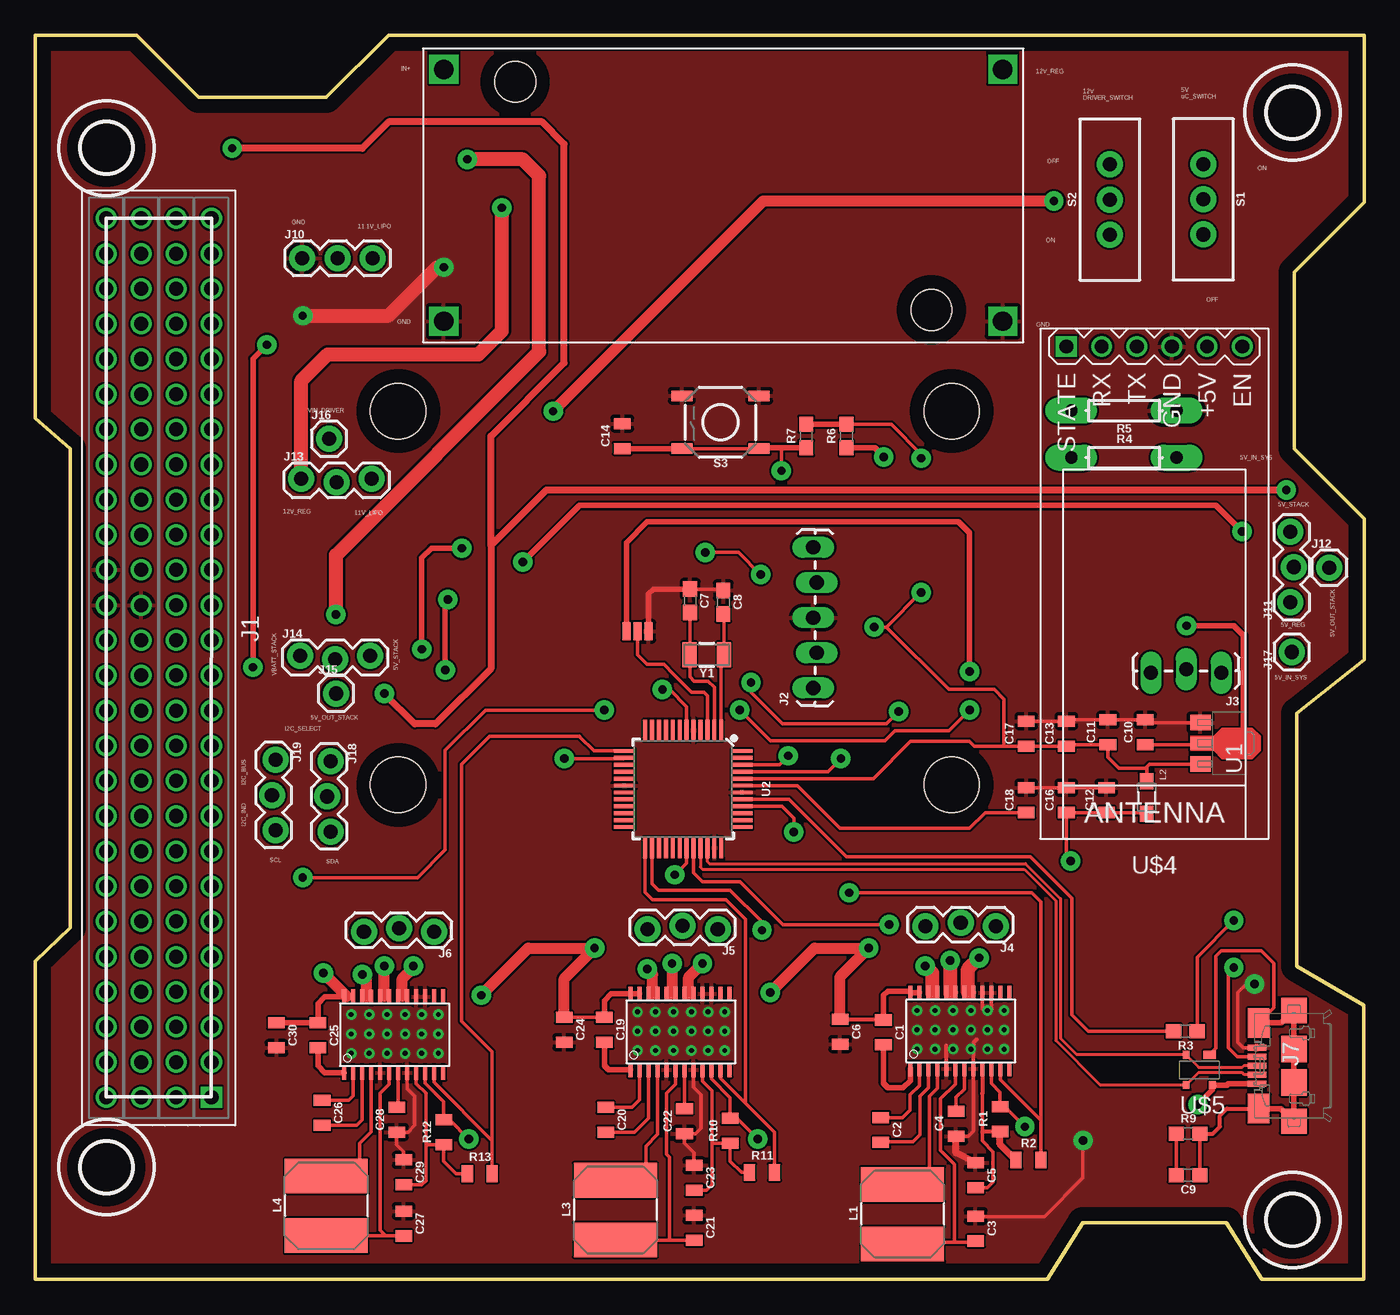
[diagram p2: board, top side]
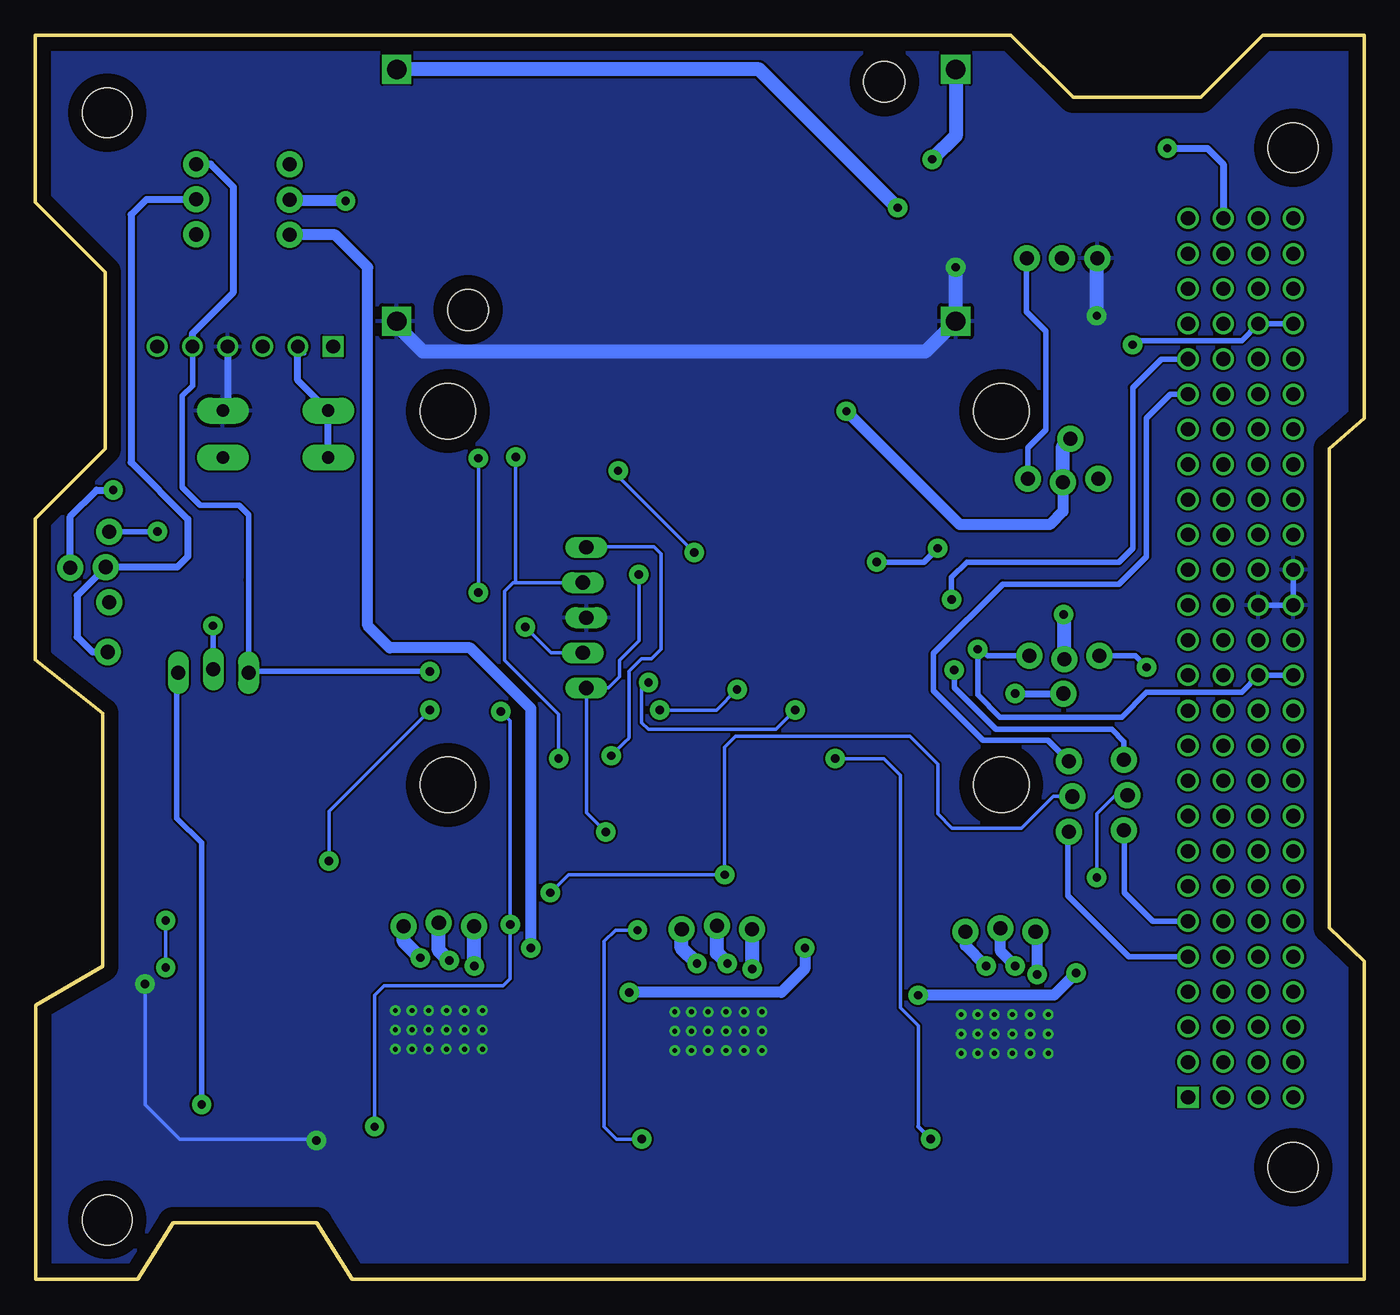
[diagram p3: board, bottom side, seen from below]

Size 96.16 x 90.01 mm. Coordinates in mm from the lower left corner, seen from the top.
Copper layers (1*16): Top 0.035mm / dielectric 1.5mm / Bottom 0.035mm
Design rules "default *": minimum track width 0.2mm, minimum drill 0.35mm, track to track 6mil, track to pad 6mil, pad to pad 6mil, via to via 6mil, smd to smd 6mil, copper to edge 40mil, drill to drill 6mil, minimum pad ring 10mil, minimum via ring 8mil, stop-mask expansion 4mil, vias tented up to drill 0mil, thermal gap 10mil
Holes 4 mm at 26.28,62.79 66.28,62.79 66.28,35.79 26.28,35.79

### Footprints (pad centres in the part's own frame; a part is rotated, then mirrored left to right if it is on the bottom)
0805 = smd 0.8 x 1.2: 1 -0.9,0; 2 0.9,0
0603 = smd 1.1 x 1: 1 -0.85,0; 2 0.85,0
SUCHAI_PCB = drill 1.016 pad 1.524 square: 1 12.72,13.16 | drill 1.016 pad 1.524: 2 12.72,15.7; 3 12.72,18.24; 4 12.72,20.78; 5 12.72,23.32; 6 12.72,25.86; 7 12.72,28.4; 8 12.72,30.94; 9 12.72,33.48; 10 12.72,36.02; 11 12.72,38.56; 12 12.72,41.1; 13 12.72,43.64; 14 12.72,46.18; 15 12.72,48.72; 16 12.72,51.26; 17 12.72,53.8; 18 12.72,56.34; 19 12.72,58.88; 20 12.72,61.42; 21 12.72,63.96; 22 12.72,66.5; 23 12.72,69.04; 24 12.72,71.58; 25 12.72,74.12; 26 12.72,76.66; 27 10.18,13.16; 28 10.18,15.7; 29 10.18,18.24; 30 10.18,20.78; 31 10.18,23.32; 32 10.18,25.86; 33 10.18,28.4; 34 10.18,30.94; 35 10.18,33.48; 36 10.18,36.02; 37 10.18,38.56; 38 10.18,41.1; 39 10.18,43.64; 40 10.18,46.18; 41 10.18,48.72; 42 10.18,51.26; 43 10.18,53.8; 44 10.18,56.34; 45 10.18,58.88; 46 10.18,61.42; 47 10.18,63.96; 48 10.18,66.5; 49 10.18,69.04; 50 10.18,71.58; 51 10.18,74.12; 52 10.18,76.66; 53 7.64,13.16; 54 7.64,15.7; 55 7.64,18.24; 56 7.64,20.78; 57 7.64,23.32; 58 7.64,25.86; 59 7.64,28.4; 60 7.64,30.94; 61 7.64,33.48; 62 7.64,36.02; 63 7.64,38.56; 64 7.64,41.1; 65 7.64,43.64; 66 7.64,46.18; 67 7.64,48.72; 68 7.64,51.26; 69 7.64,53.8; 70 7.64,56.34; 71 7.64,58.88; 72 7.64,61.42; 73 7.64,63.96; 74 7.64,66.5; 75 7.64,69.04; 76 7.64,71.58; 77 7.64,74.12; 78 7.64,76.66; 79 5.1,13.16; 80 5.1,15.7; 81 5.1,18.24; 82 5.1,20.78; 83 5.1,23.32; 84 5.1,25.86; 85 5.1,28.4; 86 5.1,30.94; 87 5.1,33.48; 88 5.1,36.02; 89 5.1,38.56; 90 5.1,41.1; 91 5.1,43.64; 92 5.1,46.18; 93 5.1,48.72; 94 5.1,51.26; 95 5.1,53.8; 96 5.1,56.34; 97 5.1,58.88; 98 5.1,61.42; 99 5.1,63.96; 100 5.1,66.5; 101 5.1,69.04; 102 5.1,71.58; 103 5.1,74.12; 104 5.1,76.66 | hole 3.6: 5.13,8.1; 90.86,4.29; 90.86,84.3; 5.13,81.76
1X05_LOCK_LONGPADS = drill 1.016 long: 1 0,0; 2 2.54,-0.254; 3 5.08,0; 4 7.62,-0.254; 5 10.16,0
1X03_LOCK_LONGPADS = drill 1.016 long: 1 0,0; 2 2.54,-0.254; 3 5.08,0
1X03_LOCK = drill 1.016 pad 1.88: 1 0,0.127; 2 2.54,-0.127; 3 5.08,0.127
MK1_ZERO_USBMICRO-ZX62-AB-5PA = smd 0.4 x 1.35: 1 -1.3,3.025; 2 -0.65,3.025; 3 0,3.025; 4 0.65,3.025; 5 1.3,3.025 | smd 2.1 x 1.6: 6 3.1,2.9; 11 -3.1,2.9 | smd 1.8 x 1.9: 7 4,0.35; 10 -4,0.35 | smd 1.9 x 1.9: 8 1.2,0.35; 9 -1.2,0.35
1X03 = drill 1.016 pad 1.88: 1 0,0; 2 2.54,0; 3 5.08,0
1X01 = drill 1.016 pad 1.88: 1 0,0
SRN6045 = smd 2.5 x 6: 1 -2.175,0; 2 2.125,0
INDC2012X87 = smd 1.15 x 1: 1 -1.175,0; 2 1.175,0
AXIAL-0.3 = drill 0.9 pad 1.88 long: P$1 -3.81,0; P$2 3.81,0
SWITCH_SPDT_PTH_11.6X4.0MM = drill 1.016 pad 1.88: 1 0,2.54; 2 0,0; 3 0,-2.54
TACTILE_SWITCH_SMD_5.2MM = smd 1.524 x 0.762: 1 -2.794,1.905; 2 2.794,1.905; 3 -2.794,-1.905; 4 2.794,-1.905
MK1_ZERO_SOT150P400X160-3N = smd 1.1 x 1.5: 1 -1.5,-1.8; 3 1.5,-1.8 | smd 0.8 x 1.5: 2 0,-1.8
TQFP-48 = smd 1.5 x 0.28: 1 -4.25,2.75; 2 -4.25,2.25; 3 -4.25,1.75; 4 -4.25,1.25; 5 -4.25,0.75; 6 -4.25,0.25; 7 -4.25,-0.25; 8 -4.25,-0.75; 9 -4.25,-1.25; 10 -4.25,-1.75; 11 -4.25,-2.25; 12 -4.25,-2.75; 25 4.25,-2.75; 26 4.25,-2.25; 27 4.25,-1.75; 28 4.25,-1.25; 29 4.25,-0.75; 30 4.25,-0.25; 31 4.25,0.25; 32 4.25,0.75; 33 4.25,1.25; 34 4.25,1.75; 35 4.25,2.25; 36 4.25,2.75 | smd 0.28 x 1.5: 13 -2.75,-4.25; 14 -2.25,-4.25; 15 -1.75,-4.25; 16 -1.25,-4.25; 17 -0.75,-4.25; 18 -0.25,-4.25; 19 0.25,-4.25; 20 0.75,-4.25; 21 1.25,-4.25; 22 1.75,-4.25; 23 2.25,-4.25; 24 2.75,-4.25; 37 2.75,4.25; 38 2.25,4.25; 39 1.75,4.25; 40 1.25,4.25; 41 0.75,4.25; 42 0.25,4.25; 43 -0.25,4.25; 44 -0.75,4.25; 45 -1.25,4.25; 46 -1.75,4.25; 47 -2.25,4.25; 48 -2.75,4.25
DRV10987 = smd 0.3 x 1.05: 1 0.3,-0.5; 2 0.95,-0.5; 3 1.6,-0.5; 4 2.25,-0.5; 5 2.9,-0.5; 6 3.55,-0.5; 7 4.2,-0.5; 8 4.85,-0.5; 9 5.5,-0.5; 10 6.15,-0.5; 11 6.8,-0.5; 12 7.45,-0.5; 13 7.45,5; 14 6.8,5; 15 6.15,5; 16 5.5,5; 17 4.85,5; 18 4.2,5; 19 3.55,5; 20 2.9,5; 21 2.25,4.98; 22 1.6,5; 23 0.95,5; 24 0.3,5
XL6009E1_MODULE = drill 1.4 square: IN+ 1.5,19.7; IN- 1.5,1.5; OUT+ 41.9,19.7; OUT- 41.9,1.5 | hole 2.95: 6.66,18.8; 36.74,2.32
CONN_03_SMD_SMALL = smd 0.6 x 1.27: P$1 -0.8,0; P$2 0,0; P$3 0.8,0
WIRELESS-BLUETOOTH-HC-05-MIRROR = drill 1 square: 1 6.35,-17.145 | drill 1: 2 3.81,-17.145; 3 1.27,-17.145; 4 -1.27,-17.145; 5 -3.81,-17.145; 6 -6.35,-17.145
ARDUINO_SOT143B = smd 0.88 x 0.55: 1 -0.75,-1.1 | smd 0.48 x 0.55: 2 0.95,-1.1; 3 0.95,1.1; 4 -0.95,1.1
CRYSTAL-SMD-3.2X1.5MM = smd 1 x 1.8: P$1 -1.25,0; P$2 1.25,0

### Placement (x,y rotation side)
C1  61.36,17.9 270 top
C2  61.17,10.85 270 top
C3  68.02,3.73 270 top
C4  66.61,11.3 90 top
C5  68.01,7.58 270 top
C6  58.23,17.95 270 top
C7  47.38,49.09 270 top
C8  49.78,48.99 270 top
C9  83.38,7.59 180 top
C10  80.28,39.59 90 top
C11  77.58,39.59 90 top
C12  77.48,34.69 90 top
C13  74.58,39.49 90 top
C14  42.48,60.99 90 top
C16  74.58,34.69 90 top
C17  71.68,39.49 90 top
C18  71.68,34.69 90 top
C19  41.18,18.09 270 top
C20  41.28,11.59 270 top
C21  47.68,3.79 270 top
C22  46.98,11.49 90 top
C23  47.68,7.39 270 top
C24  38.28,18.09 270 top
C25  20.48,17.69 270 top
C26  20.78,12.09 270 top
C27  26.68,4.09 270 top
C28  26.18,11.59 90 top
C29  26.68,7.79 270 top
C30  17.48,17.69 270 top
J1  0.06,0.06 0 top
J2  56.28,42.79 90 top
J3  85.78,43.89 180 top
J4  69.48,25.69 180 top
J5  49.38,25.49 180 top
J6  28.88,25.29 180 top
J7  91.38,15.49 90 top
J10  19.35,73.84 0 top
J11  90.88,48.99 90 top
J12  93.58,51.49 0 top
J13  19.28,57.79 0 top
J14  19.18,44.99 0 top
J15  21.78,42.39 0 top
J16  21.28,60.79 0 top
J17  90.88,45.39 90 top
J18  21.28,37.49 270 top
J19  17.28,37.59 270 top
L1  62.74,4.8 90 top
L2  80.38,34.89 270 top
L3  41.98,5.09 90 top
L4  21.08,5.39 90 top
R1  69.79,11.64 90 top
R2  71.83,8.68 0 top
R3  83.18,17.99 180 top
R4  78.75,59.44 0 top
R5  78.75,62.83 180 top
R6  58.68,60.99 90 top
R7  55.78,60.99 90 top
R9  83.38,10.59 0 top
R10  50.28,10.79 90 top
R11  52.58,7.79 0 top
R12  29.58,10.69 90 top
R13  32.18,7.69 0 top
S1  84.48,78.1 180 top
S2  77.73,78.08 0 top
S3  49.58,61.99 180 top
U1  86.08,38.79 270 top
U2  46.88,35.49 270 top
U$1  63,15.76 0 top
U$2  28.08,67.79 0 top
U$3  43.58,46.89 0 top
U$4  80.94,50.32 180 top
U$5  84.18,15.19 180 top
U$6  42.78,15.69 0 top
U$7  22.08,15.49 0 top
Y1  48.58,45.19 180 top

### Tracks (layer width: path | path; a pad name or v marks a point on that pad's centre or on a via)
3V3  (via drill 0.6 pad 1.4)
  Top 0.254: U1.3 80.58,37.29 80.38,37.09 80.38,36.99 | 80.38,36.99 L2.1 | 80.38,36.99 78.38,36.99 77.58,37.79 C11.1 74.68,38.69 C13.1 C17.1 70.08,38.59 | U2.44 60.63,36.24 63.33,38.94 67.59,38.94 67.93,38.59 70.08,38.59 | 70.08,38.59 70.08,41.99 69.38,42.69 66.08,42.69 61.58,47.19 | v60.68,47.19 60.88,47.19 61.58,47.19 | R6.2 61.93,61.84 64.08,59.69 v64.08,59.39 | v64.08,49.69 61.58,47.19
  Top 0.406: R6.2 R7.2
  Bottom 0.254: 56.6,45.39 J2.2 58.82,45.33 v60.68,47.19 | v64.08,59.39 v64.08,49.69
5V_OUT_STACK  (via drill 0.6 pad 1.4)
  Top 0.508: v90.48,57.09 36.98,57.09 32.98,53.09 | 32.98,53.09 32.98,44.19 28.98,40.19 27.48,40.19 v25.28,42.39 | 32.98,53.09 32.98,60.99 38.28,66.29 38.28,82.09 36.68,83.69 25.58,83.69 23.68,81.79 v14.28,81.79 14.08,81.79
  Bottom 0.508: J12.1 93.58,55.19 91.68,57.09 v90.48,57.09 | v25.28,42.39 J15.1 | v14.28,81.79 11.38,81.79 10.24,80.65 J1.52
5V_STACK  (via drill 0.6 pad 1.4)
  Top 0.406: v30.88,52.89 28.68,52.89 27.98,52.19 v27.98,45.59 | v35.28,51.89 39.38,55.99 85.38,55.99 v87.28,54.09
  Bottom 0.254: 5.16,43.61 J1.91
  Bottom 0.406: J1.91 J1.65 8.91,42.49 15.78,42.49 17.58,40.69 26.38,40.69 27.98,42.29 v27.98,45.59 27.26,45.12 J14.3 | J11.3 87.3,54.07 v87.28,54.09 | v35.28,51.89 31.88,51.89 v30.88,52.89
11.1V_LIPO
  Bottom 0.406: J13.3 24.36,60.16 23.06,61.46 23.06,68.57 24.48,69.99 24.48,73.79 J10.3
12V  (via drill 0.6 pad 1.4)
  Top 0.254: C19.1 C24.1
  Top 0.305: U$1.24 63.17,20.89 | C1.1 58.28,18.8 C6.1 | U$7.24 22.58,20.49 U$7.23
  Top 0.406: U$1.23 U$1.24 | 63.17,20.89 61.68,20.89 61.36,20.57 C1.1 | U$6.23 U$6.24 41.68,20.69 41.18,20.19 C19.1 | U$7.24 20.98,20.49 20.48,19.99 C25.1 C30.1
  Top 0.813: C6.1 58.23,21.94 v60.28,23.99 56.38,23.99 v53.18,20.79 | C24.1 38.28,21.79 v40.48,23.99 35.68,23.99 v32.28,20.59 | 22.58,20.49 v20.88,22.19
  Bottom 0.813: S2.3 74.43,75.54 72.08,73.19 72.08,47.29 70.48,45.69 64.68,45.69 60.28,41.29 v60.28,23.99 | v40.48,23.99 40.48,22.49 42.18,20.79 v53.18,20.79 | v20.88,22.19 22.48,20.59 v32.28,20.59
12V_REG  (via drill 0.6 pad 1.4)
  Top 1.016: J13.1 19.28,64.99 21.18,66.89 32.08,66.89 33.78,68.59 v33.78,77.49
  Bottom 1.016: v33.78,77.49 43.78,87.49 U$2.OUT+
+5V  (via drill 0.6 pad 1.4)
  Top 0.406: U$3.P$1 42.78,53.29 44.28,54.79 66.78,54.79 67.58,53.99 v67.58,43.99
  Bottom 0.406: v67.58,43.99 80.6,43.99 J3.3 80.7,50.61 80.68,50.63 80.68,55.29 81.38,55.99 84.18,55.99 85.48,57.29 85.48,63.89 84.75,64.62 U$4.5
  Bottom 0.508: U$4.5 84.75,68.42 81.78,71.39 81.78,78.99 83.43,80.64 S1.3
GND  (via drill 0.35, 0.6 pad 1.4)
  Top 0.254: 67.88,17.18 67.88,16.89 67.88,16.29 67.85,16.26 U$1.8 67.85,10.76 67.49,10.4 C4.1 | U$1.15 69.15,19.62 | 69.15,19.62 69.18,19.59 | 69.15,19.62 69.08,19.69 | 68.5,19.56 U$1.16 | C23.1 47.68,9.19 46.98,9.89 C22.1 47.78,10.59 48.18,10.99 48.18,13.39 47.63,13.94 U$6.8 | C29.1 26.68,9.29 26.18,9.79 C28.1 26.98,10.69 27.48,11.19 27.48,13.29 26.93,13.84 U$7.8 | C18.2 C16.2 C12.2 | U1.1 80.48,40.29 C10.2 C11.2 74.68,40.49 C13.2 C17.2 | C8.1 49.68,49.94 C7.1 | v75.78,10.09 75.78,7.39 72.98,4.59 68.06,4.59 C3.1 | J7.5 87.38,16.79 86.98,17.19 86.98,20.79 87.58,21.39 v88.18,21.39
  Top 0.305: 68.09,17.39 67.88,17.18 | 67.78,16.79 67.88,16.89 | U$1.5 65.9,16.96
  Top 0.406: U$3.P$3 44.38,49.59 44.73,49.94 C7.1
  Top 0.508: C5.1 66.61,9.2 C4.1
  Top 1.016: v19.38,69.69 25.58,69.69 29.08,73.19 v29.58,73.19
  Bottom 0.254: v75.78,10.09 75.88,10.19 85.68,10.19 88.18,12.69 v88.18,21.39
  Bottom 0.406: J1.67 J1.93 J1.94
  Bottom 0.508: U$4.4 82.21,63.18 R5.P$1
  Bottom 1.016: U$2.OUT- 69.98,68.99 68.08,67.09 31.78,67.09 U$2.IN- v29.58,73.19 | v19.38,69.69 19.38,73.81 J10.1
  other vias: 63.78,16.69 63.78,18.09 63.78,19.49 65.08,16.69 65.08,18.09 65.08,19.49 66.38,16.69 66.38,18.09 66.38,19.49 67.68,16.69 67.68,18.09 67.68,19.49 68.88,16.69 68.88,18.09 68.88,19.49 70.08,16.69 70.08,18.09 70.08,19.49 43.58,16.59 43.58,17.99 43.58,19.39 44.88,16.59 44.88,17.99 44.88,19.39 46.18,16.59 46.18,17.99 46.18,19.39 47.48,16.59 47.48,17.99 47.48,19.39 48.68,16.59 48.68,17.99 48.68,19.39 49.88,16.59 49.88,17.99 49.88,19.39 22.88,16.39 22.88,17.79 22.88,19.19 24.18,16.39 24.18,17.79 24.18,19.19 25.48,16.39 25.48,17.79 25.48,19.19 26.78,16.39 26.78,17.79 26.78,19.19 27.98,16.39 27.98,17.79 27.98,19.19 29.18,16.39 29.18,17.79 29.18,19.19
  pour Bottom: 0.08,0.09 73.28,-0.01 75.88,4.19 86.18,4.19 88.78,0.09 95.98,0.09 95.98,19.79 91.08,22.49 90.88,41.49 95.58,44.99 95.48,54.89 90.48,59.79 90.58,73.19 95.88,78.39 95.78,89.69 26.48,89.99 21.58,85.09 11.28,85.19 7.38,89.09 0.28,89.09 0.18,62.59 2.58,60.29 2.78,24.69 0.08,21.89
  pour Top: 0.18,0.09 73.38,-0.01 75.98,4.09 87.08,3.99 89.28,-0.01 96.48,0.09 96.48,19.79 90.88,23.19 90.98,41.39 95.98,44.99 96.08,55.09 91.08,59.89 91.18,73.29 95.78,77.99 95.88,89.99 25.88,89.99 21.28,85.29 11.88,85.19 7.68,89.69 0.08,89.79 0.28,62.89 2.58,60.79 2.58,24.59 0.28,22.29 0.08,22.09 0.08,0.09
I2C2_SCL
  Bottom 0.406: J1.6 15.31,25.92 17.38,27.99 17.38,32.49 J19.3
I2C2_SDA
  Bottom 0.406: J1.5 17.07,23.38 21.48,27.79 21.48,32.34 J18.3
I2C_SCL  (via drill 0.6 pad 1.4)
  Top 0.406: v29.68,44.09 29.68,48.99 v29.88,49.19
  Bottom 0.406: J1.22 14.71,66.56 16.78,64.49 16.78,52.89 17.78,51.89 28.78,51.89 29.88,50.79 v29.88,49.19 | J19.1 17.41,38.92 18.28,39.79 26.68,39.79 29.68,42.79 v29.68,44.09
I2C_SCL_UC  (via drill 0.6 pad 1.4)
  Top 0.254: U$1.10 69.15,14.22 69.79,13.58 R1.2 70.13,12.54 v71.58,11.09 | U2.32 47.63,29.44 48.28,28.79 50.98,28.79 54.08,25.69 v61.78,25.69 | v19.38,29.09 27.68,29.09 29.68,31.09 29.68,38.29 32.58,41.19 v41.18,41.19 | 61.57,40.19 61.58,40.2 | 61.58,40.2 v62.47,41.09 | 61.58,40.2 54.08,40.2 51.78,42.49 v51.78,43.19
  Bottom 0.254: v71.58,11.09 71.58,20.59 70.88,21.29 62.28,21.29 61.78,21.79 v61.78,25.69 61.78,40.41 v62.47,41.09 | v19.38,29.09 19.38,33.69 18.02,35.05 J19.2 | v41.18,41.19 42.58,39.79 51.78,39.79 52.28,40.29 52.28,42.69 v51.78,43.19
I2C_SCL_UC_M2  (via drill 0.6 pad 1.4)
  Top 0.254: U$6.10 48.93,14.54 50.28,13.19 R10.2 50.78,11.69 v52.28,10.19 | v52.58,25.29 52.58,25.89 50.28,28.19 45.08,28.19 44.63,28.64 U2.26
  Bottom 0.254: v52.28,10.19 54.08,10.19 54.98,11.09 54.98,24.49 54.18,25.29 v52.58,25.29
I2C_SCL_UC_M3  (via drill 0.6 pad 1.4)
  Top 0.254: U$7.10 28.23,14.24 29.58,12.89 R12.2 29.98,11.59 v31.38,10.19 | v38.28,37.69 42.58,37.69 U2.14
  Bottom 0.254: 32.28,11.09 32.28,18.39 33.58,19.69 33.58,36.49 34.78,37.69 v38.28,37.69
  Bottom 0.305: v31.38,10.19 32.28,11.09
I2C_SDA
  Bottom 0.305: 12.95,64.19 J1.21
  Bottom 0.406: J1.21 14.05,64.02 15.78,62.29 15.78,52.29 17.78,50.29 26.18,50.29 31.18,45.29 31.18,42.58 27.62,39.01 22.93,39.01 J18.1
I2C_SDA_UC  (via drill 0.6 pad 1.4)
  Top 0.254: U$1.11 69.8,14.47 72.73,11.54 | 72.73,11.54 R2.2 | 72.73,11.54 72.73,27.34 72.08,27.99 v58.88,27.99 | v46.28,29.29 47.13,30.14 U2.31
  Bottom 0.254: v58.88,27.99 57.58,29.29 v46.28,29.29 46.28,38.49 45.48,39.29 32.88,39.29 30.88,37.29 30.88,33.69 29.84,32.65 24.83,32.65 22.52,34.95 J18.2
I2C_SDA_UC_M2
  Top 0.254: U$6.11 49.58,14.59 51.33,12.84 | 51.33,12.84 53.48,10.69 R11.2 | 51.33,12.84 51.38,12.89 51.38,26.09 49.98,27.49 44.68,27.49 44.13,28.04 U2.25
I2C_SDA_UC_M3
  Top 0.254: U$7.11 28.88,14.29 33.08,10.09 | 33.08,10.09 R13.2 | U2.13 40.43,38.24 39.43,39.24 39.38,39.29 32.88,39.29 30.88,37.29 30.88,18.69 33.08,16.49 33.08,10.09
N$1
  Top 0.406: U$1.1 63.3,14.41 62.78,13.89 61.68,13.89 61.36,14.21 C1.2
N$2
  Top 0.254: U$1.2 63.95,14.06 63.28,13.39 63.28,12.29 62.74,11.75 C2.1
N$3
  Top 0.254: U$1.3 64.6,13.91 63.98,13.29 63.98,10.49 63.48,9.99 61.21,9.99 C2.2
N$4
  Top 0.254: U$1.4 65.25,13.86 64.68,13.29 64.68,7.59 64.28,7.19
  Top 0.305: L1.2 64.02,6.93 64.28,7.19
N$5
  Bottom 0.508: J17.1 91.98,45.39 93.08,46.49 93.08,49.46 J11.2 85.84,51.53 85.08,52.29 85.08,54.99 89.18,59.09 89.18,76.99 88.07,78.1 S1.2
N$6
  Top 0.254: U$1.6 66.55,14.16 65.48,13.09 65.48,9.39 66.48,8.39 66.48,2.76 | 66.48,2.76 64.49,2.76 | 66.48,2.76 67.95,2.76 C3.2
  Top 0.305: 65.01,2.79 64.49,2.76 63.19,2.66 L1.1
N$7
  Top 0.254: U$1.7 67.2,13.81 66.61,13.22 C4.2
N$8
  Top 0.254: U2.2 49.13,42.84 48.68,43.29 47.68,43.29 47.38,43.59 47.38,45.14 Y1.P$2 47.38,45.24 C7.2
N$9
  Top 0.254: 68.5,13.47 68.5,10.69 68.5,10.07 69.28,9.29 69.28,7.09 68.87,6.68 C5.2
  Top 0.305: U$1.9 68.5,13.47 | R1.1 68.55,10.74 68.5,10.69
  Top 0.508: R2.1 69.79,9.82 R1.1
N$10
  Top 0.254: U2.1 49.63,44.99 Y1.P$1 49.83,48.09 C8.2
N$11  (via drill 0.6 pad 1.4)
  Top 0.254: J7.4 86.93,16.14 86.28,16.79 86.28,22.09 86.68,22.49 v86.68,22.59 | v86.68,25.99 84.03,23.34 R3.1
  Bottom 0.254: v86.68,22.59 v86.68,25.99
N$13
  Bottom 0.305: 76.64,66.98 U$4.2
  Bottom 0.508: R4.P$1 R5.P$2 77.13,65.02 U$4.2
N$16  (via drill 0.6 pad 1.4)
  Top 0.813: v37.48,62.79 52.68,77.99 v73.68,77.99
  Bottom 0.813: J13.2 21.82,55.55 22.78,54.59 29.28,54.59 v37.48,62.79 | v73.68,77.99 77.64,77.99 S2.2
  Bottom 1.016: J13.2 21.82,60.25 J16.1
N$17
  Top 0.2: 88.38,18.59 J7.6
  Top 0.254: U$5.1 85.38,16.74 85.38,23.39 85.78,23.79 88.68,23.79 89.58,22.89 89.58,19.69 J7.6 | R9.2 C9.1
  Top 0.305: R9.2 85.18,10.59 85.68,11.09 85.68,11.89 86.18,12.39 J7.11
  Top 0.406: J7.6 90.13,18.59 J7.7 J7.8 J7.9 J7.10 90.98,11.49 90.08,12.39 J7.11
N$18  (via drill 0.6 pad 1.4)
  Top 1.016: v21.78,48.09 21.78,52.39 36.48,67.09 36.48,79.79 35.28,80.99 v31.28,80.99
  Bottom 1.016: J14.2 21.72,48.03 v21.78,48.09 | U$2.IN+ 29.58,82.69 v31.28,80.99
N$19
  Top 0.254: R9.1 C9.2
N$20  (via drill 0.6 pad 1.4)
  Top 0.254: C10.1 84.18,38.69 U1.2
  Top 0.406: v83.28,47.29 86.68,47.29 87.38,46.59 87.38,39.39 86.78,38.79 U1.2
  Bottom 0.406: J3.2 83.24,47.25 v83.28,47.29
N$22
  Top 0.406: U$6.1 41.48,15.19 41.18,15.49 C19.2
N$23
  Top 0.254: U$6.2 43.73,13.04 43.18,12.49 C20.1
N$24
  Top 0.254: U$6.3 44.38,11.69 43.38,10.69 C20.2
N$25
  Top 0.254: L3.2 43.71,7.22 44.18,7.69 44.18,9.69 45.03,10.54 U$6.4
N$26
  Top 0.254: C21.2 45.78,2.89 | 45.78,2.89 42.01,2.89 L3.1 | U$6.6 46.33,14.14 45.68,13.49 45.68,9.09 45.88,8.89 45.88,2.99 45.78,2.89
N$27
  Top 0.254: U$6.7 C22.2
N$28
  Top 0.254: U$6.9 48.28,14.39 48.98,13.69 48.98,9.89 | C23.2 48.58,6.49 48.98,6.89 48.98,9.89 | 48.98,9.89 R10.1 50.28,8.59 51.08,7.79 R11.1
N$29
  Top 0.406: C25.2 20.48,15.49 20.98,14.99 U$7.1
N$30
  Top 0.254: U$7.2 23.03,13.34 22.68,12.99 C26.1
N$31
  Top 0.254: U$7.3 23.68,11.59 23.28,11.19 C26.2
N$32
  Top 0.254: U$7.4 24.33,10.74 23.48,9.89 23.48,8.19 22.81,7.52 L4.2
N$33
  Top 0.254: U$7.6 25.63,14.14 24.98,13.49 24.98,3.59 25.38,3.19 | 25.38,3.19 C27.2 | 25.38,3.19 21.11,3.19 L4.1
N$34
  Top 0.254: C28.2 26.28,12.59 U$7.7
N$35
  Top 0.254: U$7.9 27.58,14.19 28.28,13.49 28.28,9.79 | 28.28,9.79 28.28,7.19 27.98,6.89 C29.2 | 28.28,9.79 R12.1 29.58,8.59 30.48,7.69 R13.1
OUT1  (via drill 0.6 pad 1.4)
  Top 0.406: U$1.18 67.48,20.76 U$1.17
  Top 1.016: 67.48,20.76 67.48,22.49 v68.28,23.29
  Bottom 1.016: v68.28,23.29 69.48,24.49 J4.1
OUT1_M2  (via drill 0.6 pad 1.4)
  Top 0.305: U$6.18 47.28,20.69 U$6.17
  Top 0.813: v48.28,22.89 47.28,21.89 47.28,20.69
  Bottom 1.016: v48.28,22.89 49.38,23.99 J5.1
OUT1_M3  (via drill 0.6 pad 1.4)
  Top 0.305: U$7.18 26.58,20.49 U$7.17
  Top 0.813: 26.58,20.49 26.58,21.79 27.38,22.59 v27.38,22.69
  Bottom 0.813: v27.38,22.69 28.88,24.19 J6.1
OUT2  (via drill 0.6 pad 1.4)
  Top 0.406: U$1.20 66.18,20.76 U$1.19
  Top 1.016: 66.18,20.76 v66.18,23.09
  Bottom 1.016: v66.18,23.09 66.94,23.85 J4.2
OUT2_M2  (via drill 0.6 pad 1.4)
  Top 0.305: U$6.20 45.98,20.69 U$6.19
  Top 0.813: 45.98,22.79 v46.08,22.89 46.08,20.79 45.98,20.69
  Bottom 1.016: v46.08,22.89 46.84,23.65 J5.2
OUT2_M3  (via drill 0.6 pad 1.4)
  Top 0.305: U$7.20 25.28,20.49 U$7.19
  Top 0.813: 25.28,20.49 v25.28,22.69
  Bottom 0.813: v25.28,22.69 26.34,23.75 J6.2
OUT3  (via drill 0.6 pad 1.4)
  Top 0.305: 65.23,20.76 U$1.21
  Top 0.406: U$1.22 64.88,20.76 65.23,20.76
  Top 1.016: 64.88,20.76 64.88,22.19 v64.38,22.69
  Bottom 1.016: v64.38,22.69 64.38,25.55 J4.3
OUT3_M2  (via drill 0.6 pad 1.4)
  Top 0.305: U$6.22 44.4,20.67 44.68,20.67 U$6.21
  Top 0.813: 44.68,20.67 44.68,22.09 v44.28,22.49
  Bottom 1.016: v44.28,22.49 44.28,25.35 J5.3
OUT3_M3  (via drill 0.6 pad 1.4)
  Top 0.305: U$7.22 23.7,20.47 23.98,20.47 U$7.21
  Top 0.813: 23.98,20.47 23.98,21.79 v23.68,22.09
  Bottom 0.813: v23.68,22.09 23.68,25.05 J6.3
RESET  (via drill 0.6 pad 1.4)
  Top 0.254: U2.40 54.03,34.24 54.88,33.39 v54.88,32.39 | S3.2 S3.1 | v52.48,50.99 50.88,52.59 v48.48,52.59 | v53.98,58.49 53.98,60.14
  Top 0.406: C14.1 S3.2 | R7.1 53.98,60.14 52.43,60.14 S3.1
  Bottom 0.254: v54.88,32.39 56.28,33.79 J2.1 54.68,42.79 53.88,43.59 53.88,44.79 52.48,46.19 v52.48,50.99 | v48.48,52.59 53.98,58.09 v53.98,58.49
SPEED_CTL_M1
  Top 0.254: U2.3 48.63,42.24 48.38,42.49 47.48,42.49 46.28,43.69 46.18,43.79 45.48,44.49 44.28,44.49 43.58,45.19 U$3.P$2
SWCLK  (via drill 0.6 pad 1.4)
  Top 0.254: U2.45 57.33,36.74 v58.28,37.69
  Top 0.406: R6.1 60.73,60.14 v61.38,59.49
  Bottom 0.254: v58.28,37.69 58.28,40.89 62.18,44.79 62.18,49.79 61.58,50.39 61.38,50.39 | 61.38,50.39 56.56,50.39 J2.4 | v61.38,59.49 61.38,50.39
SWDIO  (via drill 0.6 pad 1.4)
  Top 0.254: U2.46 53.83,37.24 v54.48,37.89
  Bottom 0.254: v54.48,37.89 53.43,38.94 53.28,39.09 53.18,39.19 53.18,43.99 52.28,44.89 51.58,44.89 50.88,45.59 50.88,52.49 51.38,52.99 56.24,52.99 J2.5
T_USB_N
  Top 0.2: J7.2 88.33,14.87 87.43,14.87 87.28,15.02 84.16,15.02 U$5.3 77.03,14.09 73.81,17.32 73.81,27.42 71.53,29.69 48.28,29.69 48.13,29.84 U2.33
T_USB_P
  Top 0.2: J7.3 88.33,15.52 87.44,15.52 87.28,15.37 84.16,15.37 U$5.2 75.33,16.29 74.16,17.47 74.16,27.57 71.63,30.09 48.78,30.09 48.63,30.24 U2.34
USB_HOST_EN
  Top 0.254: U2.41 54.53,34.74 58.68,30.59 71.98,30.59 74.98,27.59 74.98,19.19 76.18,17.99 R3.2
V_BATT_STACK  (via drill 0.6 pad 1.4)
  Top 0.406: v16.78,67.59 15.78,66.59 v15.78,44.29
  Bottom 0.406: J1.101 J1.75 8.91,67.89 15.08,67.89 16.48,67.89 v16.78,67.59 | J14.1 17.18,45.12 16.86,45.12 16.61,45.12 v15.78,44.29
V_USB  (via drill 0.6 pad 1.4)
  Top 0.406: J7.1 86.28,14.19 86.18,14.09 U$5.4 85.13,13.74 v84.08,12.69
  Bottom 0.406: v84.08,12.69 84.08,31.59 85.88,33.39 85.88,43.79 J3.1
VDDANA  (via drill 0.6 pad 1.4)
  Top 0.254: L2.2 80.31,33.79 C12.1 C16.1 74.58,30.59 v74.88,30.29 | v67.58,41.19 66.08,39.69 62.18,39.69 61.48,38.99 53.18,38.99 v50.98,41.19 | U2.6 47.13,41.44 45.88,42.69 v45.38,42.69
  Bottom 0.254: v74.88,30.29 74.88,33.89 v67.58,41.19 | v45.38,42.69 46.88,41.19 v50.98,41.19
VDDCORE
  Top 0.254: U2.43 55.13,35.74 58.23,32.65 67.59,32.65 68.73,33.79 C18.1

### Text on the board
tPlace: IN+ | 12V_REG | 5V / uC_SWITCH | 12V / DRIVER_SWITCH | OFF | ON | GND | 11.1V_LIPO | ON | OFF | GND | GND | VIN_DRIVER | 5V_IN_SYS | 12V_REG | 11V_LIPO | 5V_STACK | 5V_REG | 5V_OUT_STACK | VBATT_STACK | 5V_STACK | 5V_IN_SYS | 5V_OUT_STACK | I2C_SELECT | I2C_BUS | I2C_IND | SCL | SDA